# EAGLE schematic untitled (EAGLE 8.2.0)
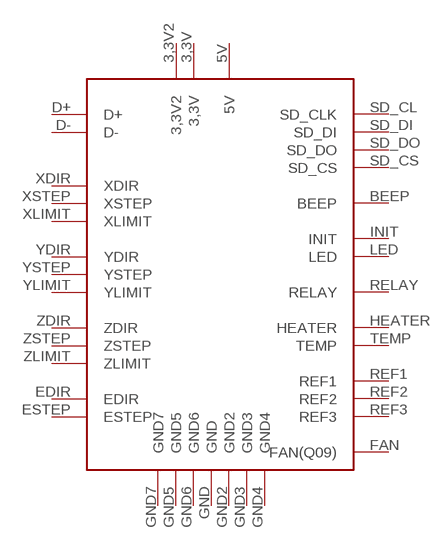
[diagram p0: schematic, sheet 1]

## Parts
U$1  CETUS_CONTROLLER  [CETUS_CONTROLLER]
Unconnected: U$1.3,3V U$1.3,3V2 U$1.5V U$1.BEEP U$1.D+ U$1.D- U$1.EDIR U$1.ESTEP U$1.FAN(FAN(Q09)) U$1.GND U$1.GND2 U$1.GND3 U$1.GND4 U$1.GND5 U$1.GND6 U$1.GND7 U$1.HEATER U$1.INIT U$1.LED U$1.REF1 U$1.REF2 U$1.REF3 U$1.RELAY U$1.SD_CL(SD_CLK) U$1.SD_CS U$1.SD_DI U$1.SD_DO U$1.TEMP U$1.XDIR U$1.XLIMIT U$1.XSTEP U$1.YDIR U$1.YLIMIT U$1.YSTEP U$1.ZDIR U$1.ZLIMIT U$1.ZSTEP

## Library data of the parts
U$1 = cetus:CETUS_CONTROLLER